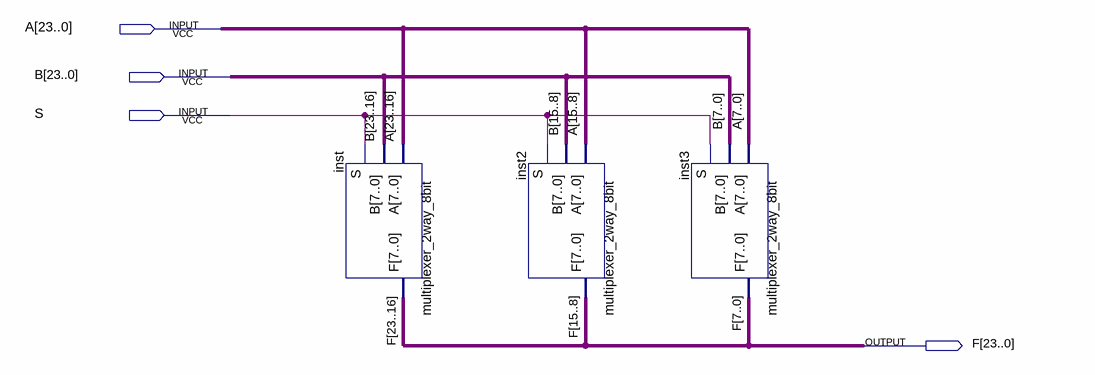
[diagram p0: schematic sheet]
// Quartus schematic multiplexer_2way_24bit.bdf as structural Verilog: 3 symbols, 4 pins
module multiplexer_2way_24bit (
  input  [23:0] A,
  input  [23:0] B,
  input  S,
  output [23:0] F
);

  multiplexer_2way_8bit inst (.A(A[23:16]), .B(B[23:16]), .S(S), .F(F[23:16]));
  multiplexer_2way_8bit inst2 (.A(A[15:8]), .B(B[15:8]), .S(S), .F(F[15:8]));
  multiplexer_2way_8bit inst3 (.A(A[7:0]), .B(B[7:0]), .S(S), .F(F[7:0]));
endmodule
